# EAGLE schematic axiom_beta_plugin_module_3xmDP_v1.1.077a9bbb (EAGLE 7.7.0)
Assembly variants: Beta
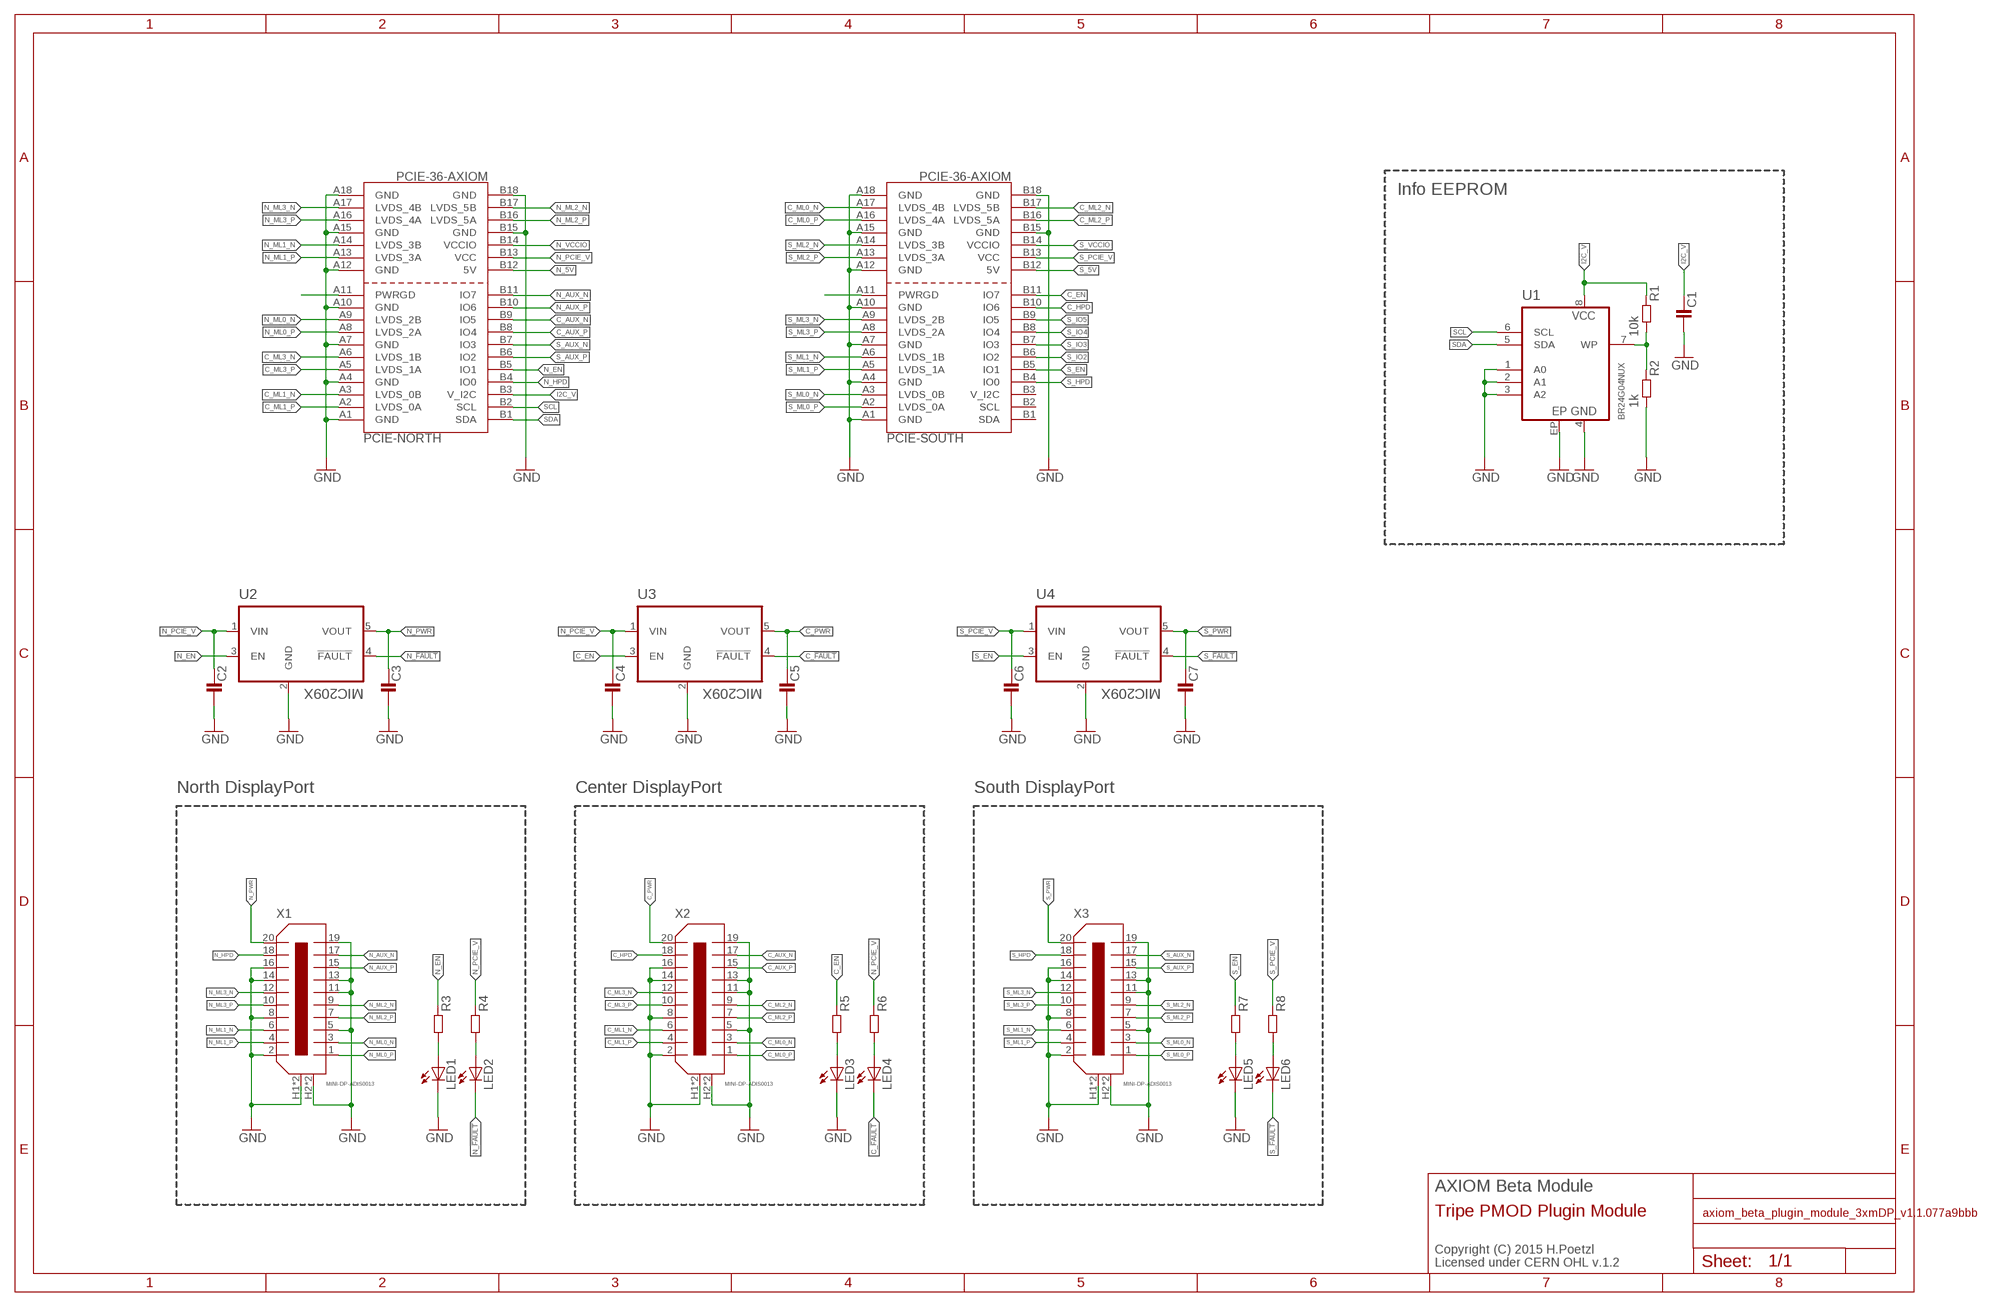
[diagram p0: schematic, sheet 1]

## Parts
C1  C0402-B  [0402-B]
C2  C0603-B  [0603-B]
C3  C0603-B  [0603-B]
C4  C0603-B  [0603-B]
C5  C0603-B  [0603-B]
C6  C0603-B  [0603-B]
C7  C0603-B  [0603-B]
LED1  LEDCHIPLED_0603  [CHIPLED_0603]
LED2  LEDCHIPLED_0603  [CHIPLED_0603]
LED3  LEDCHIPLED_0603  [CHIPLED_0603]
LED4  LEDCHIPLED_0603  [CHIPLED_0603]
LED5  LEDCHIPLED_0603  [CHIPLED_0603]
LED6  LEDCHIPLED_0603  [CHIPLED_0603]
PCIE-NORTH  PCIE-36-AXIOM  [PCIE-36-AXIOM]  (not fitted in variant Beta)
PCIE-SOUTH  PCIE-36-AXIOM  [PCIE-36-AXIOM]  (not fitted in variant Beta)
R1  10k  R0402-B  [0402-B]
R2  1k  R0402-B  [0402-B]
R3  R0402-B  [0402-B]
R4  R0402-B  [0402-B]
R5  R0402-B  [0402-B]
R6  R0402-B  [0402-B]
R7  R0402-B  [0402-B]
R8  R0402-B  [0402-B]
U1  BR24G04NUX  [DFN200X300X100-9N]
U2  MIC209X  [SOT95P280X145-5N]
U3  MIC209X  [SOT95P280X145-5N]
U4  MIC209X  [SOT95P280X145-5N]
X1  MINI-DP-ADIS0013  [ADIS0013]
X2  MINI-DP-ADIS0013  [ADIS0013]
X3  MINI-DP-ADIS0013  [ADIS0013]

## Nets
C_!FAULT: LED4.C U3.4(!FAULT)
C_AUX_N: PCIE-NORTH.B9(IO5) X2.17
C_AUX_P: PCIE-NORTH.B8(IO4) X2.15
C_EN: PCIE-SOUTH.B11(IO7) R5.1 U3.3(EN)
C_HPD: PCIE-SOUTH.B10(IO6) X2.18
C_ML0_N: PCIE-SOUTH.A17(LVDS_4B) X2.3
C_ML0_P: PCIE-SOUTH.A16(LVDS_4A) X2.1
C_ML1_N: PCIE-NORTH.A3(LVDS_0B) X2.6
C_ML1_P: PCIE-NORTH.A2(LVDS_0A) X2.4
C_ML2_N: PCIE-SOUTH.B17(LVDS_5B) X2.9
C_ML2_P: PCIE-SOUTH.B16(LVDS_5A) X2.7
C_ML3_N: PCIE-NORTH.A6(LVDS_1B) X2.12
C_ML3_P: PCIE-NORTH.A5(LVDS_1A) X2.10
C_PWR: C5.1 U3.5(VOUT) X2.20
GND: C1.2 C2.2 C3.2 C4.2 C5.2 C6.2 C7.2 LED1.C LED3.C LED5.C PCIE-NORTH.A1(GND) PCIE-NORTH.A4(GND) PCIE-NORTH.A7(GND) PCIE-NORTH.A10(GND) PCIE-NORTH.A12(GND) PCIE-NORTH.A15(GND) PCIE-NORTH.A18(GND) PCIE-NORTH.B15(GND) PCIE-NORTH.B18(GND) PCIE-SOUTH.A1(GND) PCIE-SOUTH.A4(GND) PCIE-SOUTH.A7(GND) PCIE-SOUTH.A10(GND) PCIE-SOUTH.A12(GND) PCIE-SOUTH.A15(GND) PCIE-SOUTH.A18(GND) PCIE-SOUTH.B15(GND) PCIE-SOUTH.B18(GND) R2.2 U1.1(A0) U1.2(A1) U1.3(A2) U1.4(GND) U1.EP U2.2(GND) U3.2(GND) U4.2(GND) X1.2 X1.5 X1.8 X1.11 X1.13 X1.14 X1.16 X1.19 X1.H1(M) X1.H2(M) X1.H3(M) X1.H4(M) X2.2 X2.5 X2.8 X2.11 X2.13 X2.14 X2.16 X2.19 X2.H1(M) X2.H2(M) X2.H3(M) X2.H4(M) X3.2 X3.5 X3.8 X3.11 X3.13 X3.14 X3.16 X3.19 X3.H1(M) X3.H2(M) X3.H3(M) X3.H4(M)
I2C_V: C1.1 PCIE-NORTH.B3(V_I2C) R1.1 U1.8(VCC)
N$196: LED3.A R5.2
N$197: LED4.A R6.2
N$198: LED1.A R3.2
N$202: LED2.A R4.2
N$209: PCIE-NORTH.A11(PWRGD)
N$216: R1.2 R2.1 U1.7(WP)
N$256: PCIE-SOUTH.A11(PWRGD)
N$324: LED5.A R7.2
N$325: LED6.A R8.2
N_5V: PCIE-NORTH.B12(5V)
N_!FAULT: LED2.C U2.4(!FAULT)
N_AUX_N: PCIE-NORTH.B11(IO7) X1.17
N_AUX_P: PCIE-NORTH.B10(IO6) X1.15
N_EN: PCIE-NORTH.B5(IO1) R3.1 U2.3(EN)
N_HPD: PCIE-NORTH.B4(IO0) X1.18
N_ML0_N: PCIE-NORTH.A9(LVDS_2B) X1.3
N_ML0_P: PCIE-NORTH.A8(LVDS_2A) X1.1
N_ML1_N: PCIE-NORTH.A14(LVDS_3B) X1.6
N_ML1_P: PCIE-NORTH.A13(LVDS_3A) X1.4
N_ML2_N: PCIE-NORTH.B17(LVDS_5B) X1.9
N_ML2_P: PCIE-NORTH.B16(LVDS_5A) X1.7
N_ML3_N: PCIE-NORTH.A17(LVDS_4B) X1.12
N_ML3_P: PCIE-NORTH.A16(LVDS_4A) X1.10
N_PCIE_V: C2.1 C4.1 PCIE-NORTH.B13(VCC) R4.1 R6.1 U2.1(VIN) U3.1(VIN)
N_PWR: C3.1 U2.5(VOUT) X1.20
N_VCCIO: PCIE-NORTH.B14(VCCIO)
S_5V: PCIE-SOUTH.B12(5V)
S_!FAULT: LED6.C U4.4(!FAULT)
S_AUX_N: PCIE-NORTH.B7(IO3) X3.17
S_AUX_P: PCIE-NORTH.B6(IO2) X3.15
S_EN: PCIE-SOUTH.B5(IO1) R7.1 U4.3(EN)
S_HPD: PCIE-SOUTH.B4(IO0) X3.18
S_IO2: PCIE-SOUTH.B6(IO2)
S_IO3: PCIE-SOUTH.B7(IO3)
S_IO4: PCIE-SOUTH.B8(IO4)
S_IO5: PCIE-SOUTH.B9(IO5)
S_ML0_N: PCIE-SOUTH.A3(LVDS_0B) X3.3
S_ML0_P: PCIE-SOUTH.A2(LVDS_0A) X3.1
S_ML1_N: PCIE-SOUTH.A6(LVDS_1B) X3.6
S_ML1_P: PCIE-SOUTH.A5(LVDS_1A) X3.4
S_ML2_N: PCIE-SOUTH.A14(LVDS_3B) X3.9
S_ML2_P: PCIE-SOUTH.A13(LVDS_3A) X3.7
S_ML3_N: PCIE-SOUTH.A9(LVDS_2B) X3.12
S_ML3_P: PCIE-SOUTH.A8(LVDS_2A) X3.10
S_PCIE_V: C6.1 PCIE-SOUTH.B13(VCC) R8.1 U4.1(VIN)
S_PWR: C7.1 U4.5(VOUT) X3.20
S_VCCIO: PCIE-SOUTH.B14(VCCIO)
SCL: PCIE-NORTH.B2(SCL) U1.6(SCL)
SDA: PCIE-NORTH.B1(SDA) U1.5(SDA)
Unconnected: PCIE-SOUTH.B1(SDA) PCIE-SOUTH.B2(SCL) PCIE-SOUTH.B3(V_I2C)

## Notes on the sheet
- Info EEPROM
- North DisplayPort | Center DisplayPort | South DisplayPort
- AXIOM Beta Module
- Tripe PMOD Plugin Module
- Copyright (C) 2015 H.Poetzl
  Licensed under CERN OHL v.1.2

## Library data of the parts
C1-C7 = generic-rcl:C
LED1-LED6 = led:LED: LED OSRAM: - CHIPLED LG R971, LG N971, LY N971, LG Q971, LY Q971, LO R971, LY R971 LH N974, LH R974 LS Q976, LO Q976, LY Q976 LO Q996 - Hyper CHIPLED LW Q18S LB Q993, LB Q99A, LB R99A - SideLED LS A670, LO A670, LY A670, LG A670, LP A670 LB A673, LV A673, LT A673, LW A673 LH A674 LY A675 LS A676, LA A676, LO A676, LY A676, LW A676 LS A679, LY A679, LG A679 - Hyper Micro SIDELED® LS Y876, LA Y876, LO Y876, LY Y876 LT Y87S - SmartLED LW L88C, LW L88S LB L89C, LB L89S, LG L890 LS L89K, LO L89K, LY L89K LS L896, LA L896, LO L896, LY L896 - TOPLED LS T670, LO T670, LY T670, LG T670, LP T670 LSG T670, LSP T670, LSY T670, LOP T670, LYG T670 LG T671, LOG T671, LSG T671 LB T673, LV T673, LT T673, LW T673 LH T674 LS T676, LA T676, LO T676, LY T676, LB T676, LH T676, LSB T676, LW T676 LB T67C, LV T67C, LT T67C, LS T67K, LO T67K, LY T67K, LW E67C LS E67B, LA E67B, LO E67B, LY E67B, LB E67C, LV E67C, LT E67C LW T67C LS T679, LY T679, LG T679 LS T770, LO T770, LY T770, LG T770, LP T770 LB T773, LV T773, LT T773, LW T773 LH T774 LS E675, LA E675, LY E675, LS T675 LS T776, LA T776, LO T776, LY T776, LB T776 LHGB T686 LT T68C, LB T68C - Hyper Mini TOPLED® LB M676 - Mini TOPLED Santana® LG M470 LS M47K, LO M47K, LY M47K Source: http://www.osram.convergy.de LUXEON: - LUMILED® LXK2-PW12-R00, LXK2-PW12-S00, LXK2-PW14-U00, LXK2-PW14-V00 LXK2-PM12-R00, LXK2-PM12-S00, LXK2-PM14-U00 LXK2-PE12-Q00, LXK2-PE12-R00, LXK2-PE12-S00, LXK2-PE14-T00, LXK2-PE14-U00 LXK2-PB12-K00, LXK2-PB12-L00, LXK2-PB12-M00, LXK2-PB14-N00, LXK2-PB14-P00, LXK2-PB14-Q00 LXK2-PR12-L00, LXK2-PR12-M00, LXK2-PR14-Q00, LXK2-PR14-R00 LXK2-PD12-Q00, LXK2-PD12-R00, LXK2-PD12-S00 LXK2-PH12-R00, LXK2-PH12-S00 LXK2-PL12-P00, LXK2-PL12-Q00, LXK2-PL12-R00 Source: www.luxeon.com KINGBRIGHT: KA-3528ASYC Source: www.kingbright.com
PCIE-NORTH PCIE-SOUTH = PCIe:PCIE-36-AXIOM
R1-R8 = generic-rcl:R
U1 = eeprom:BR24G04
U2-U4 = mic209x:MIC209X: Current Limiting Power Distribution Switches; MPN: MIC2090-1YM5TR; OC_FARNELL: 1924707; OC_NEWARK: 58T4896; PACKAGE: SOT-23-5; SUPPLIER: MICREL SEMICONDUCTOR
X1-X3 = displayport:MINI-DP: RIGHT ANGLE MINI-DISPLAYPORT RECEPTACLE Source: http://www.molex.com/pdm_docs/sd/1050810001_sd.pdf

## Net classes
0 default: width 0.152 mm, drill 0.254 mm, clearance 0.152 mm
1 LVDS: width 0.152 mm, drill 0.254 mm, clearance 0.152 mm